# Altium project PRIMJENJENA.PrjPcb
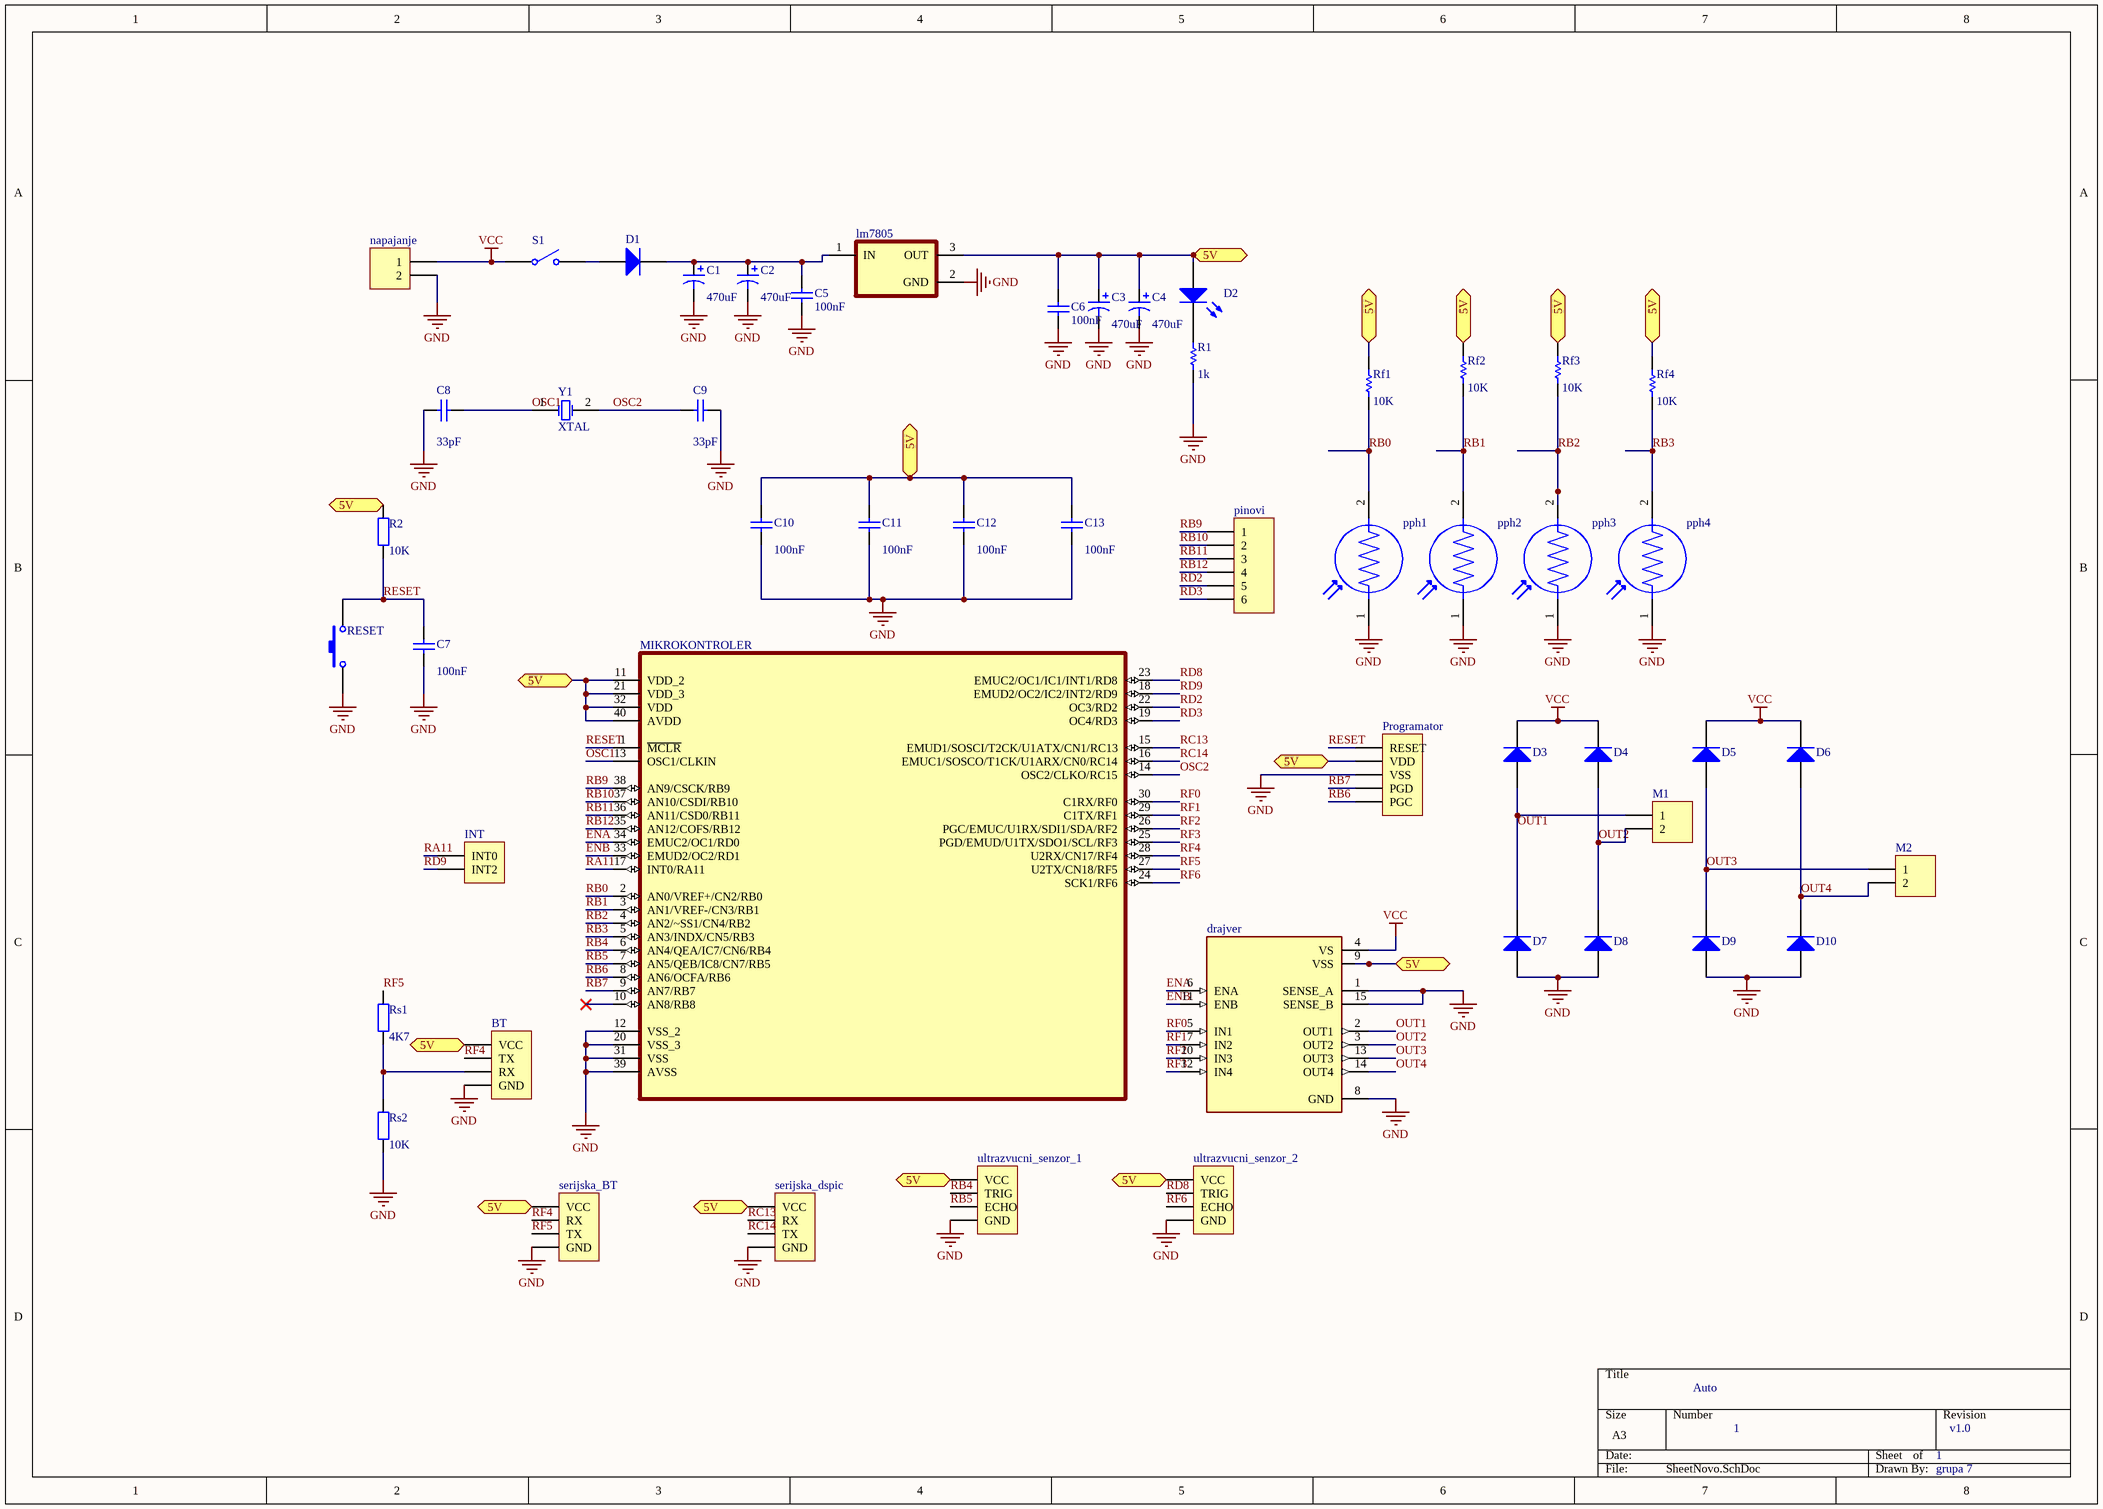
[diagram p0: SheetNovo.SchDoc]
1 sheet, 52 parts. Net scope: flat (ports and power ports of the same name join across sheets).
Board file: PCBnovi2.PcbDoc

## Sheet SheetNovo.SchDoc
size A3

### Parts
BT  Header 4  [HDR1X4]  (value not drawn)
C1  value 470uF  [470uF]  (hidden comment: Cap Pol1)
C2  value 470uF  [470uF]  (hidden comment: Cap Pol1)
C3  value 470uF  [470uF]  (hidden comment: Cap Pol1)
C4  value 470uF  [470uF]  (hidden comment: Cap Pol1)
C5  value 100nF  [Kondenzator]  (hidden comment: Cap)
C6  value 100nF  [Kondenzator]  (hidden comment: Cap)
C7  value 100nF  [Kondenzator]  (hidden comment: Cap)
C8  value 33pF  [Kondenzator]  (hidden comment: Cap)
C9  value 33pF  [Kondenzator]  (hidden comment: Cap)
C10  value 100nF  [Kondenzator]  (hidden comment: Cap)
C11  value 100nF  [Kondenzator]  (hidden comment: Cap)
C12  value 100nF  [Kondenzator]  (hidden comment: Cap)
C13  value 100nF  [Kondenzator]  (hidden comment: Cap)
D1  Diode 1N4007  [1X2]  (value not drawn)
D2  LED0  [LED]  (value not drawn)
D3  Diode 1N4007  [DO-41]  (value not drawn)
D4  Diode 1N4007  [DO-41]  (value not drawn)
D5  Diode 1N4007  [DO-41]  (value not drawn)
D6  Diode 1N4007  [DO-41]  (value not drawn)
D7  Diode 1N4007  [DO-41]  (value not drawn)
D8  Diode 1N4007  [DO-41]  (value not drawn)
D9  Diode 1N4007  [DO-41]  (value not drawn)
D10  Diode 1N4007  [DO-41]  (value not drawn)
drajver  L298N  [L298N]  (value not drawn)
INT  Header 2  [HDR1X2]  (value not drawn)
lm7805  LM7805CT/NOPB  [L7805]  (value not drawn)
M1  Header 2  [HDR1X2]  (value not drawn)
M2  Header 2  [HDR1X2]  (value not drawn)
MIKROKONTROLER  DSPIC30F4013-20E/P  [DIP254P1524X635-40]  (value not drawn)
napajanje  Header 2  [HDR1X2]  (value not drawn)
pinovi  Header 6  [HDR1X6]  (value not drawn)
pph1  PDV-P9003-1  [XDCR_PDV-P9003-1]  (value not drawn)
pph2  PDV-P9003-1  [XDCR_PDV-P9003-1]  (value not drawn)
pph3  PDV-P9003-1  [XDCR_PDV-P9003-1]  (value not drawn)
pph4  PDV-P9003-1  [XDCR_PDV-P9003-1]  (value not drawn)
Programator  Header 5  [HDR1X5]  (value not drawn)
R1  value 1k  [AXIAL-0.3]  (hidden comment: Res1)
R2  value 10K  [AXIAL-0.4]  (hidden comment: Res2)
RESET  SW-PB  [Taster 6 mm]  (value not drawn)
Rf1  value 10K  [AXIAL-0.3]  (hidden comment: Res1)
Rf2  value 10K  [AXIAL-0.3]  (hidden comment: Res1)
Rf3  value 10K  [AXIAL-0.3]  (hidden comment: Res1)
Rf4  value 10K  [AXIAL-0.3]  (hidden comment: Res1)
Rs1  value 4K7  [AXIAL-0.4]  (hidden comment: Res2)
Rs2  value 10K  [AXIAL-0.4]  (hidden comment: Res2)
S1  SW-SPST  [KIPP]  (value not drawn)
serijska_BT  Header 4  [HDR1X4]  (value not drawn)
serijska_dspic  Header 4  [HDR1X4]  (value not drawn)
ultrazvucni_senzor_1  H  [HDR1X4]  (value not drawn)
ultrazvucni_senzor_2  Header 4  [HDR1X4]  (value not drawn)
Y1  XTAL  [Oscilator]

### Ports
5V

### Nets
GND: BT.4(GND) C1.2 C2.2 C3.2 C4.2 C5.2 C6.1 C7.2 C8.1 C9.2 C10.1 C11.1 C12.1 C13.2 D7.1(A) D8.1(A) D9.1(A) D10.1(A) drajver.1(SENSE_A) drajver.8(GND) drajver.15(SENSE_B) lm7805.2(GND) MIKROKONTROLER.12(VSS_2) MIKROKONTROLER.20(VSS_3) MIKROKONTROLER.31(VSS) MIKROKONTROLER.39(AVSS) napajanje.2 pph1.1 pph2.1 pph3.1 pph4.1 Programator.3(VSS) R1.1 RESET.1 Rs2.2 serijska_BT.4(GND) serijska_dspic.4(GND) ultrazvucni_senzor_1.4(GND) ultrazvucni_senzor_2.4(GND)
VCC: D3.2(K) D4.2(K) D5.2(K) D6.2(K) drajver.4(VS) napajanje.1 S1.1(COMMON)
ENA: drajver.6(ENA) MIKROKONTROLER.34(EMUC2/OC1/RD0)
ENB: drajver.11(ENB) MIKROKONTROLER.33(EMUD2/OC2/RD1)
OSC1: C8.2 MIKROKONTROLER.13(OSC1/CLKIN) Y1.1(OSC1)
OSC2: C9.1 MIKROKONTROLER.14(OSC2/CLKO/RC15) Y1.2(OSC2)
OUT1: D3.1(A) D7.2(K) drajver.2(OUT1) M1.1
OUT2: D4.1(A) D8.2(K) drajver.3(OUT2) M1.2
OUT3: D5.1(A) D9.2(K) drajver.13(OUT3) M2.1
OUT4: D6.1(A) D10.2(K) drajver.14(OUT4) M2.2
RA11: INT.1(INT0) MIKROKONTROLER.17(INT0/RA11)
RB0: MIKROKONTROLER.2(AN0/VREF+/CN2/RB0) pph1.2 Rf1.1
RB1: MIKROKONTROLER.3(AN1/VREF-/CN3/RB1) pph2.2 Rf2.1
RB2: MIKROKONTROLER.4(AN2/~SS1/CN4/RB2) pph3.2 Rf3.1
RB3: MIKROKONTROLER.5(AN3/INDX/CN5/RB3) pph4.2 Rf4.1
RB4: MIKROKONTROLER.6(AN4/QEA/IC7/CN6/RB4) ultrazvucni_senzor_1.2(TRIG)
RB5: MIKROKONTROLER.7(AN5/QEB/IC8/CN7/RB5) ultrazvucni_senzor_1.3(ECHO)
RB6: MIKROKONTROLER.8(AN6/OCFA/RB6) Programator.5(PGC)
RB7: MIKROKONTROLER.9(AN7/RB7) Programator.4(PGD)
RB9: MIKROKONTROLER.38(AN9/CSCK/RB9) pinovi.1
RB10: MIKROKONTROLER.37(AN10/CSDI/RB10) pinovi.2
RB11: MIKROKONTROLER.36(AN11/CSD0/RB11) pinovi.3
RB12: MIKROKONTROLER.35(AN12/COFS/RB12) pinovi.4
RC13: MIKROKONTROLER.15(EMUD1/SOSCI/T2CK/U1ATX/CN1/RC13) serijska_dspic.2(RX)
RC14: MIKROKONTROLER.16(EMUC1/SOSCO/T1CK/U1ARX/CN0/RC14) serijska_dspic.3(TX)
RD2: MIKROKONTROLER.22(OC3/RD2) pinovi.5
RD3: MIKROKONTROLER.19(OC4/RD3) pinovi.6
RD8: MIKROKONTROLER.23(EMUC2/OC1/IC1/INT1/RD8) ultrazvucni_senzor_2.2(TRIG)
RD9: INT.2(INT2) MIKROKONTROLER.18(EMUD2/OC2/IC2/INT2/RD9)
RESET: C7.1 MIKROKONTROLER.1(~{MCLR}) Programator.1(RESET) R2.1 RESET.2
RF0: drajver.5(IN1) MIKROKONTROLER.30(C1RX/RF0)
RF1: drajver.7(IN2) MIKROKONTROLER.29(C1TX/RF1)
RF2: drajver.10(IN3) MIKROKONTROLER.26(PGC/EMUC/U1RX/SDI1/SDA/RF2)
RF3: drajver.12(IN4) MIKROKONTROLER.25(PGD/EMUD/U1TX/SDO1/SCL/RF3)
RF4: BT.2(TX) MIKROKONTROLER.28(U2RX/CN17/RF4) serijska_BT.2(RX)
RF5: MIKROKONTROLER.27(U2TX/CN18/RF5) Rs1.2 serijska_BT.3(TX)
RF6: MIKROKONTROLER.24(SCK1/RF6) ultrazvucni_senzor_2.3(ECHO)
NetBT_1: BT.1(VCC) C3.1 C4.1 C6.2 C10.2 C11.2 C12.2 C13.1 D2.1(A) drajver.9(VSS) lm7805.3(OUT) MIKROKONTROLER.11(VDD_2) MIKROKONTROLER.21(VDD_3) MIKROKONTROLER.32(VDD) MIKROKONTROLER.40(AVDD) Programator.2(VDD) R2.2 Rf1.2 Rf2.2 Rf3.2 Rf4.2 serijska_BT.1(VCC) serijska_dspic.1(VCC) ultrazvucni_senzor_1.1(VCC) ultrazvucni_senzor_2.1(VCC) ; port 5V
NetBT_3: BT.3(RX) Rs1.1 Rs2.1
NetC1_1: C1.1 C2.1 C5.1 D1.2(K) lm7805.1(IN)
NetD1_1: D1.1(A) S1.2(NO)
NetD2_2: D2.2(K) R1.2

Not connected (* = marked no-connect by the designer): MIKROKONTROLER 10(AN8/RB8)*

### Notes on the sheet
- Auto
- 1
- v1.0
- grupa 7

### Library data of the parts
BT serijska_BT serijska_dspic ultrazvucni_senzor_1 ultrazvucni_senzor_2 = Header 4: Header, 4-Pin; LatestRevisionDate: 17-Jul-2002; LatestRevisionNote: Re-released for DXP Platform.; Publisher: Altium Limited
C1-C4 = Cap Pol1: Polarized Capacitor (Radial); Published: 8-Jun-2000; LatestRevisionDate: 17-Jul-2002; LatestRevisionNote: Re-released for DXP Platform.; PackageReference: RB7.6-15; Publisher: Altium Limited; PackageDescription: Polarized Capacitor (Radial); 2 Leads
C5-C13 = Cap: Capacitor; Published: 8-Jun-2000; LatestRevisionDate: 17-Jul-2002; LatestRevisionNote: Re-released for DXP Platform.; PackageReference: RAD-0.3; Publisher: Altium Limited; PackageDescription: Radial Cap, Thru-Hole; 2 Leads; 0.3 in Pin Spacing
D1 D3-D10 = Diode 1N4007: 1 Amp General Purpose Rectifier; Published: 8-Jun-2000; LatestRevisionDate: 17-Jul-2002; LatestRevisionNote: Re-released for DXP Platform.; DatasheetVersion: 1998; PackageVersion: Aug-1999; PackageReference: DO-41; Publisher: Altium Limited; PackageDescription: Diode, Axial; Body 5.2 x 2.7 mm (LxDia. max), Lead Dia. 0.86 mm (max); Code_JEDEC: DO-204-AL; ComponentLink1Description: Manufacturer Link; ComponentLink1URL: http://www.fairchildsemi.com/; ComponentLink2Description: Datasheet; ComponentLink2URL: http://www.fairchildsemi.com/ds/1N%2F1N4001.pdf
D2 = LED0: Typical INFRARED GaAs LED; Published: 8-Jun-2000; LatestRevisionDate: 08-Jul-2005; LatestRevisionNote: Mech Layer 1 removed.; PackageReference: LED-0; Publisher: Altium Limited; PackageDescription: LED; 2 Leads
drajver = L298N: Dual Full Bridge Motor Driver 15-Pin(15+Tab) MULTIWATT V Tube; MP: L298N; Availability: Unavailable; Package: None; Value: *; Price: None
INT M1 M2 napajanje = Header 2: Header, 2-Pin; LatestRevisionDate: 17-Jul-2002; LatestRevisionNote: Re-released for DXP Platform.; Publisher: Altium Limited
lm7805 = LM7805CT/NOPB: Linear Voltage Regulator IC Positive Fixed 1 Output 1.5A TO-220-3; MF: ON Semiconductor; Purchase-URL: https://pricing.snapeda.com/search/part/LM7805CT/?ref=eda; Check_prices: https://www.snapeda.com/parts/LM7805CT/Onsemi/view-part/?ref=eda; SnapEDA_Link: https://www.snapeda.com/parts/LM7805CT/Onsemi/view-part/?ref=snap; Price: None; Availability: In Stock; Package: TO-220-3 ON Semiconductor; MP: LM7805CT; Value: *
MIKROKONTROLER = DSPIC30F4013-20E/P: dsPIC dsPICâ„¢ 30F Microcontroller IC 16-Bit 20 MIPS 48KB _16K x 24_ FLASH 40-PDIP; MF: Microchip; Package: DIP-40 Microchip; Digi-Key_Part_Number: DSPIC30F4013-20EP-ND; Digi-Key_Purchase_URL: https://www.digikey.rs/product-detail/en/microchip-technology/DSPIC30F4013-20E-P/DSPIC30F4013-20EP-ND/739428?utm_source=snapeda&utm_medium=aggregator&utm_campaign=symbol; Value: *; MP: DSPIC30F4013-20E/P; SnapEDA_Link: https://www.snapeda.com/parts/DSPIC30F4013-20E/P/Microchip/view-part/143007/?ref=snap
pinovi = Header 6: Header, 6-Pin; LatestRevisionDate: 17-Jul-2002; LatestRevisionNote: Re-released for DXP Platform.; Publisher: Altium Limited
pph1-pph4 = PDV-P9003-1: CdS Cells 520nm 23 ~ 33kOhms @ 10 lux; MF: Advanced Photonix; Availability: Unavailable; Value: *; Price: None; SnapEDA_Link: https://www.snapeda.com/parts/PDV-P9003-1/Advanced%20Photonix/view-part/58967/?ref=snap; MP: PDV-P9003-1; Package: Radial Advanced Photonix
Programator = Header 5: Header, 5-Pin; LatestRevisionDate: 17-Jul-2002; LatestRevisionNote: Re-released for DXP Platform.; Publisher: Altium Limited
R1 Rf1-Rf4 = Res1: Resistor; Published: 8-Jun-2000; LatestRevisionDate: 17-Jul-2002; LatestRevisionNote: Re-released for DXP Platform.; PackageReference: AXIAL-0.3; Publisher: Altium Limited; PackageDescription: Axial Device, Thru-Hole; 2 Leads; 0.3 in Pin Spacing
R2 Rs1 Rs2 = Res2: Resistor; Published: 8-Jun-2000; LatestRevisionDate: 17-Jul-2002; LatestRevisionNote: Re-released for DXP Platform.; PackageReference: AXIAL-0.4; Publisher: Altium Limited; PackageDescription: Axial Device, Thru-Hole; 2 Leads; 0.4 in Pin Spacing
RESET = SW-PB: Switch; Published: 24-Mar-1999; LatestRevisionDate: 17-Jul-2002; LatestRevisionNote: Re-released for DXP Platform.; PackageReference: SPST-2; Publisher: Altium Limited; PackageDescription: Switch; 2 Leads
S1 = SW-SPST: Single-Pole, Single-Throw Switch; Published: 24-Mar-1999; LatestRevisionDate: 17-Jul-2002; LatestRevisionNote: Re-released for DXP Platform.; PackageReference: SPST-2; Publisher: Altium Limited; PackageDescription: Switch; 2 Leads
Y1 = XTAL: Crystal Oscillator; Published: 8-Jun-2000; LatestRevisionDate: 17-Jul-2002; LatestRevisionNote: Re-released for DXP Platform.; PackageReference: R38; Publisher: Altium Limited; PackageDescription: Crystal, Thru-Hole; 2 Leads; Body 3.1 x 8.2 mm (Dia.xH)